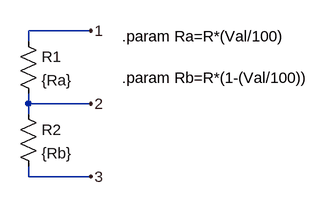
[diagram p0: schematic pot.asc]
pot.asc, the LTspice schematic file:
Version 4
SHEET 1 880 680
WIRE 240 80 144 80
WIRE 144 96 144 80
WIRE 144 192 144 176
WIRE 240 192 144 192
WIRE 144 208 144 192
WIRE 144 304 144 288
WIRE 240 304 144 304
FLAG 240 80 1
FLAG 240 192 2
FLAG 240 304 3
SYMBOL res 128 80 R0
SYMATTR InstName R1
SYMATTR Value {Ra}
SYMBOL res 128 192 R0
SYMATTR InstName R2
SYMATTR Value {Rb}
TEXT 288 88 Left 2 !.param Ra=R*(Val/100)
TEXT 288 152 Left 2 !.param Rb=R*(1-(Val/100))

The netlist it stands for:
* pot.asc
R1 1 2 {Ra}
R2 2 3 {Rb}
.param Ra=R*(Val/100)
.param Rb=R*(1-(Val/100))
.backanno
.end